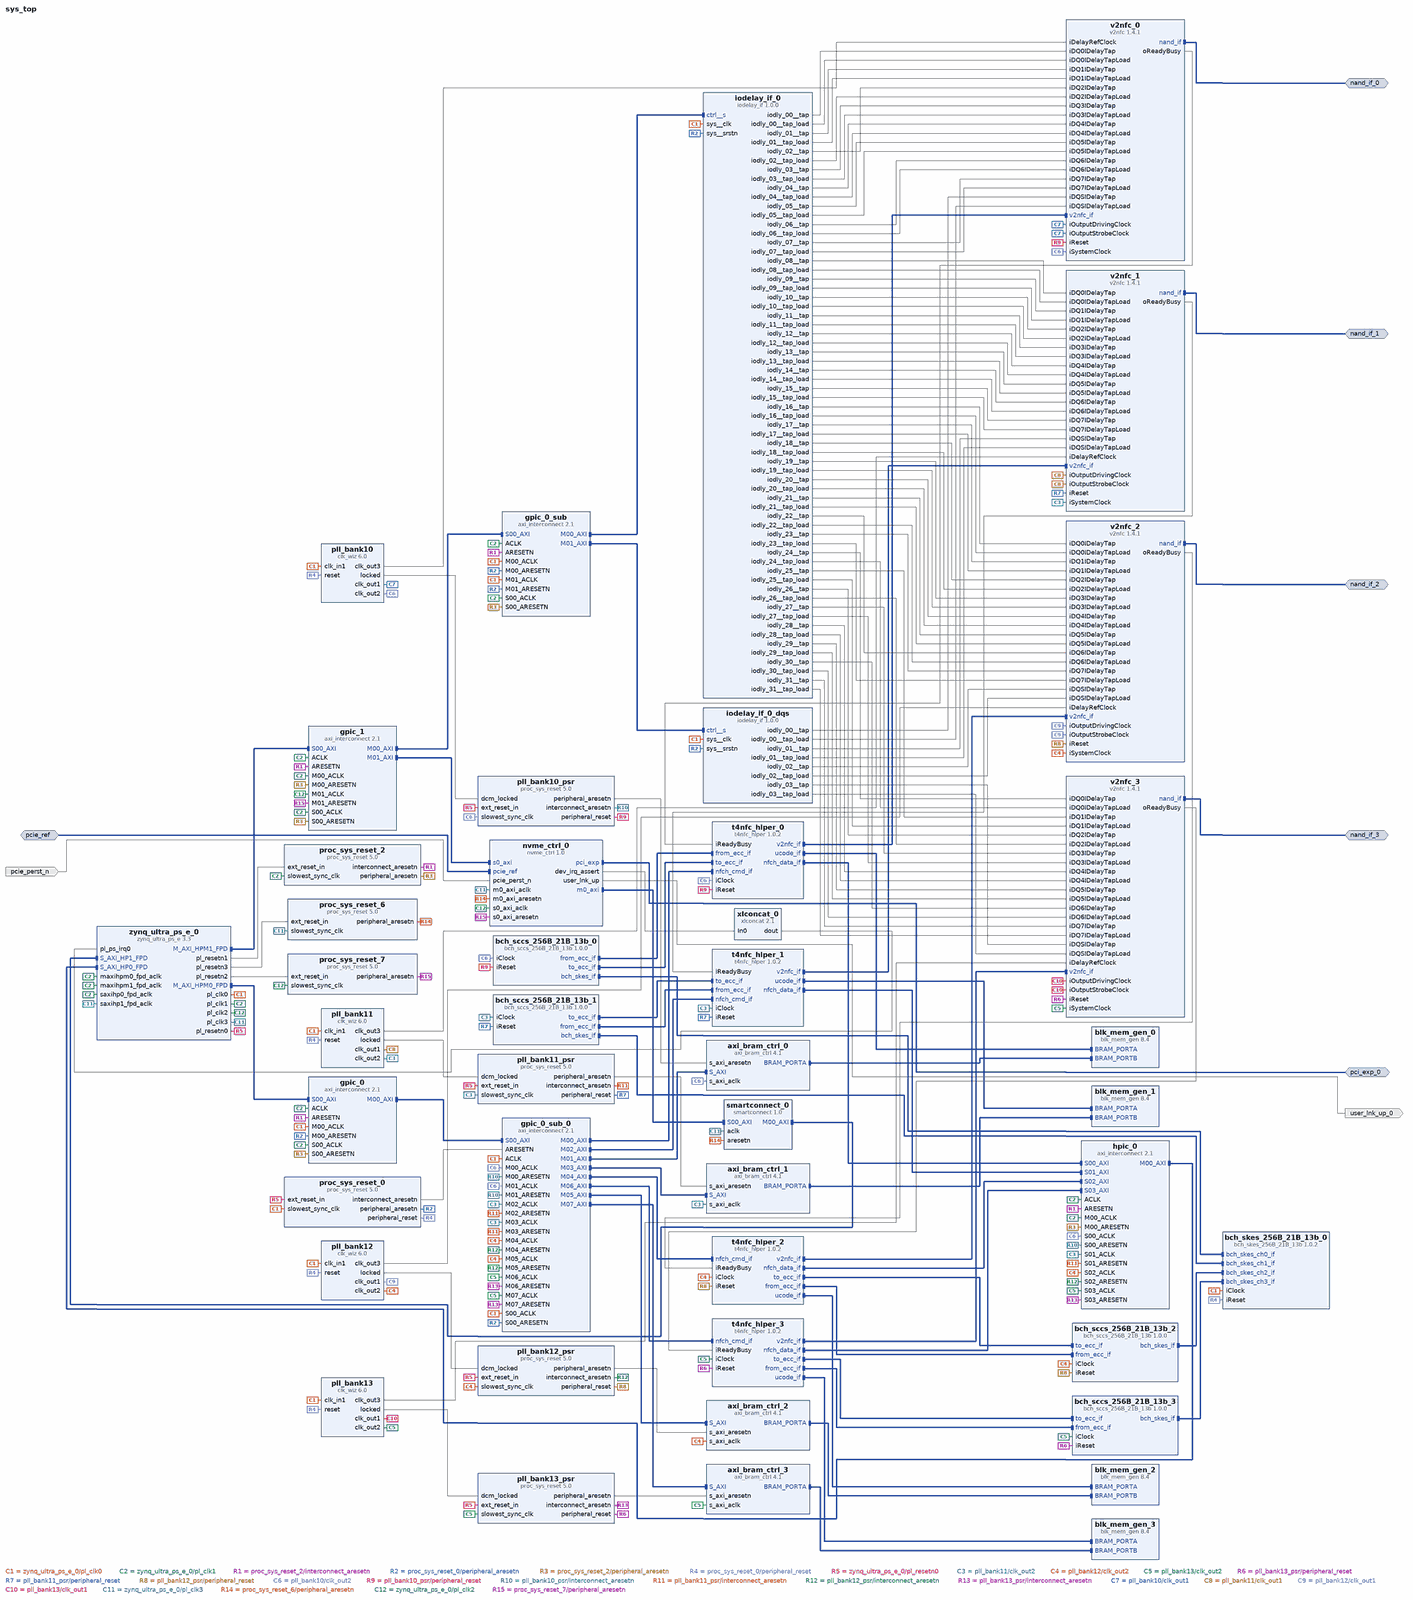
[diagram p0: block diagram of the top level, whole]
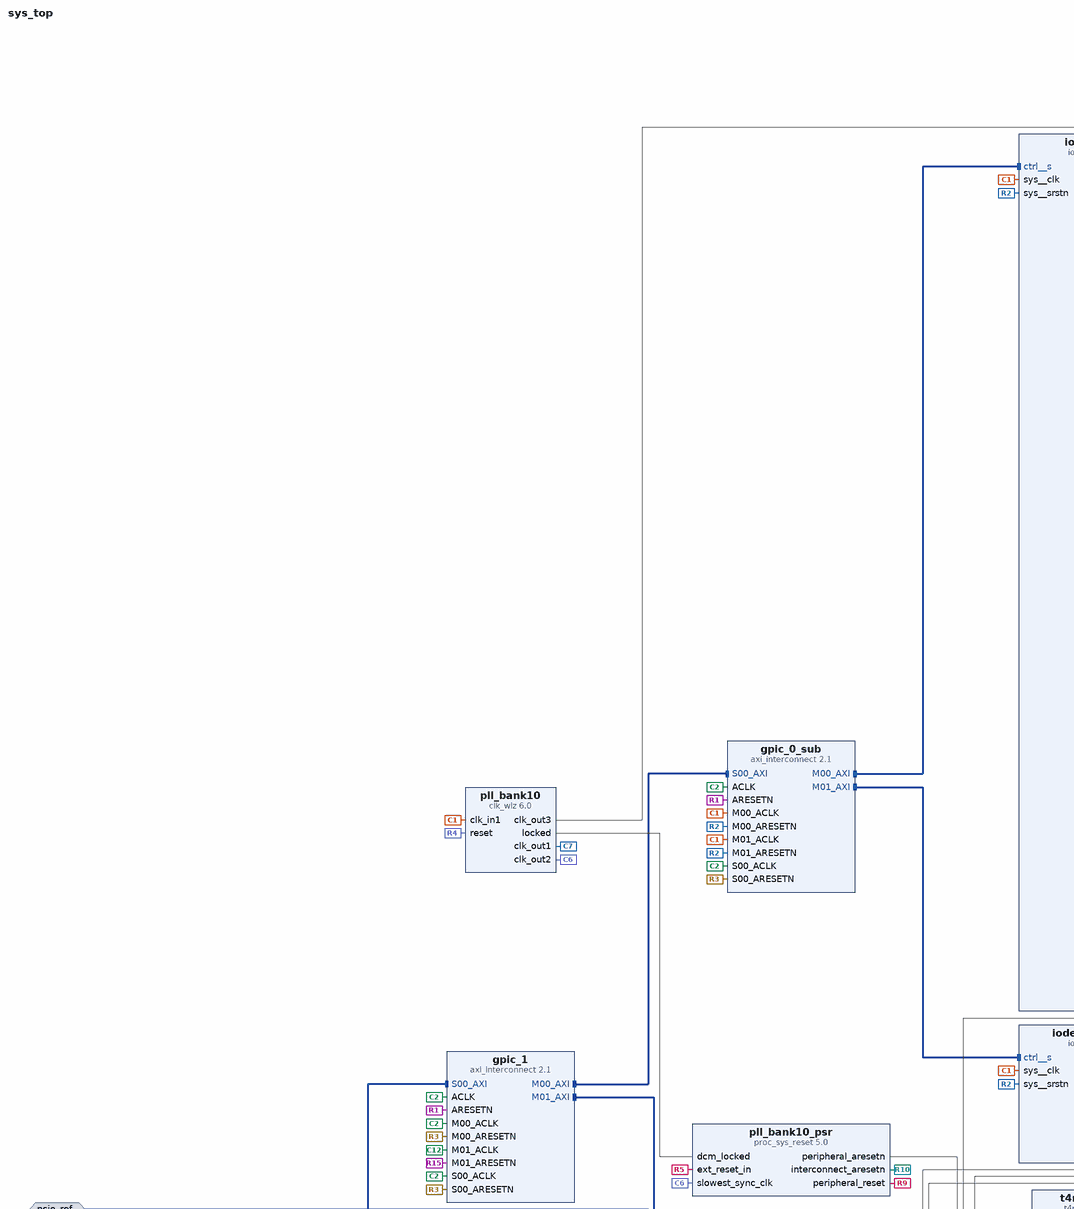
[diagram p1: block diagram of the top level, upper left part]
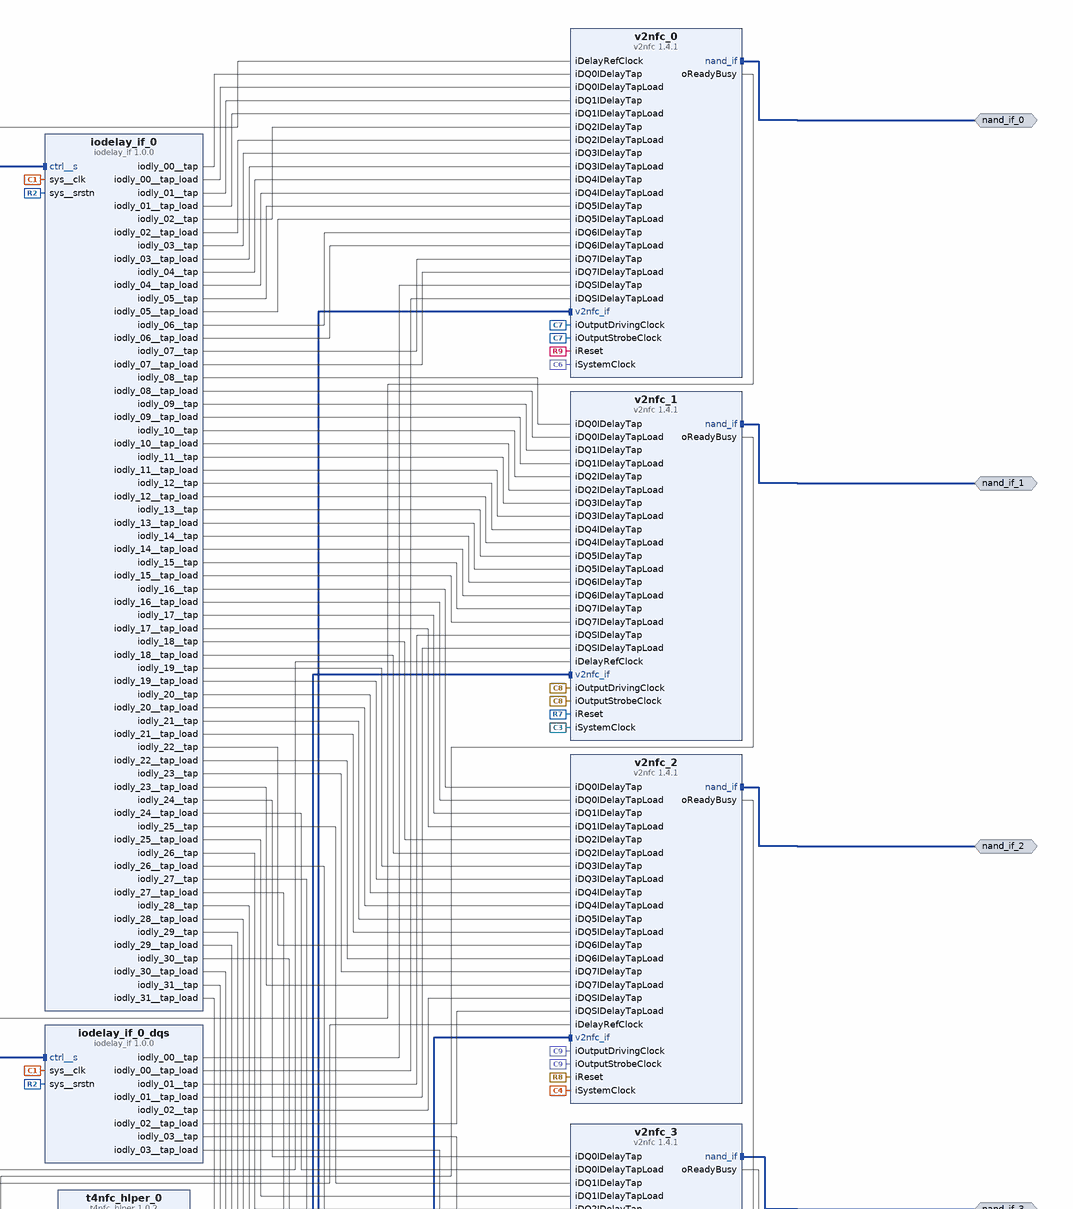
[diagram p2: block diagram of the top level, upper right part]
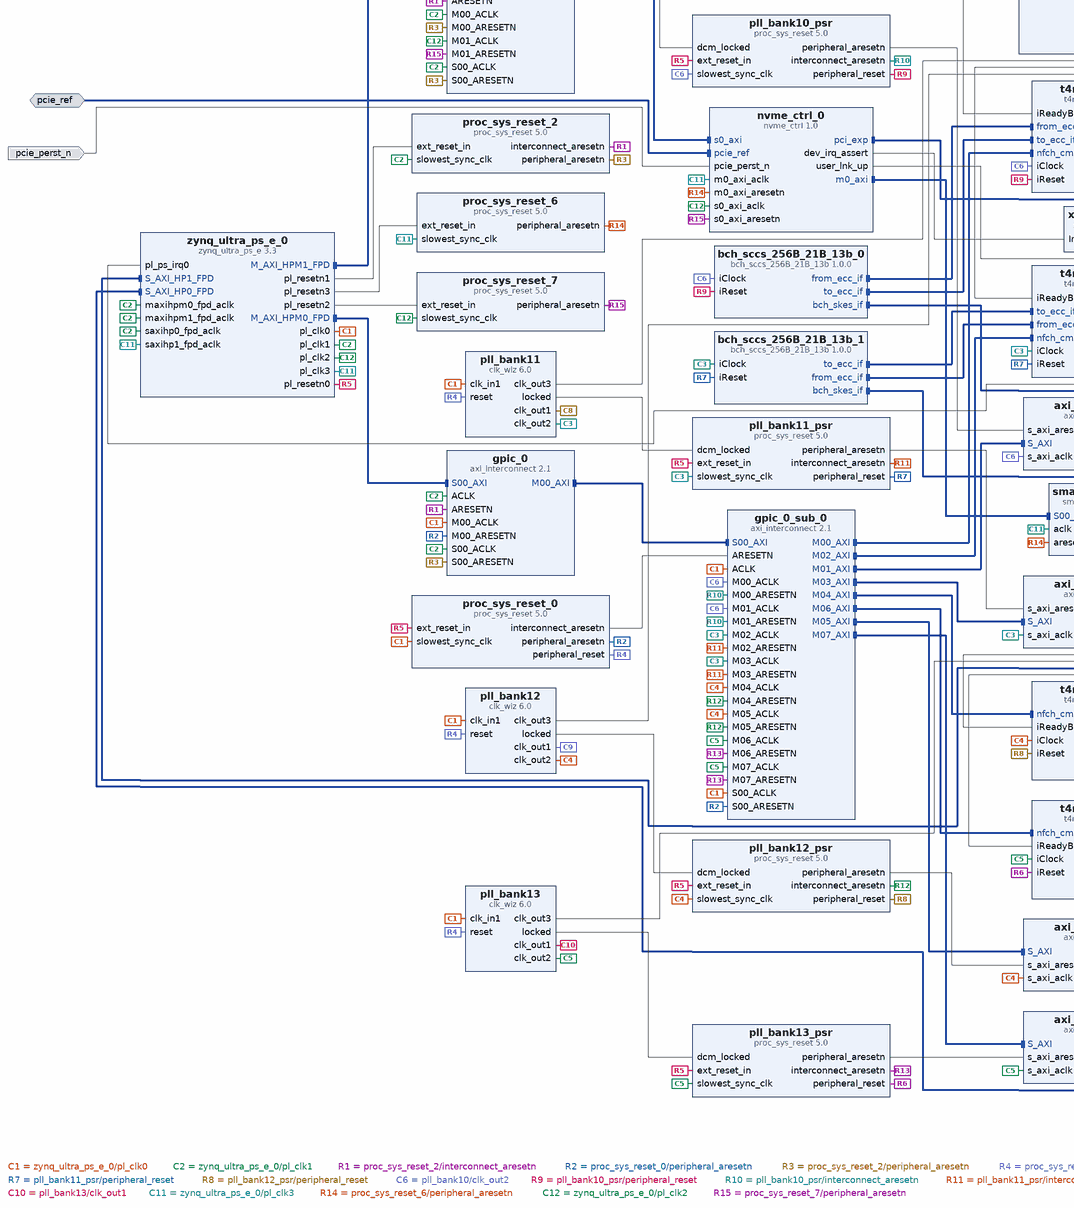
[diagram p3: block diagram of the top level, lower left part]
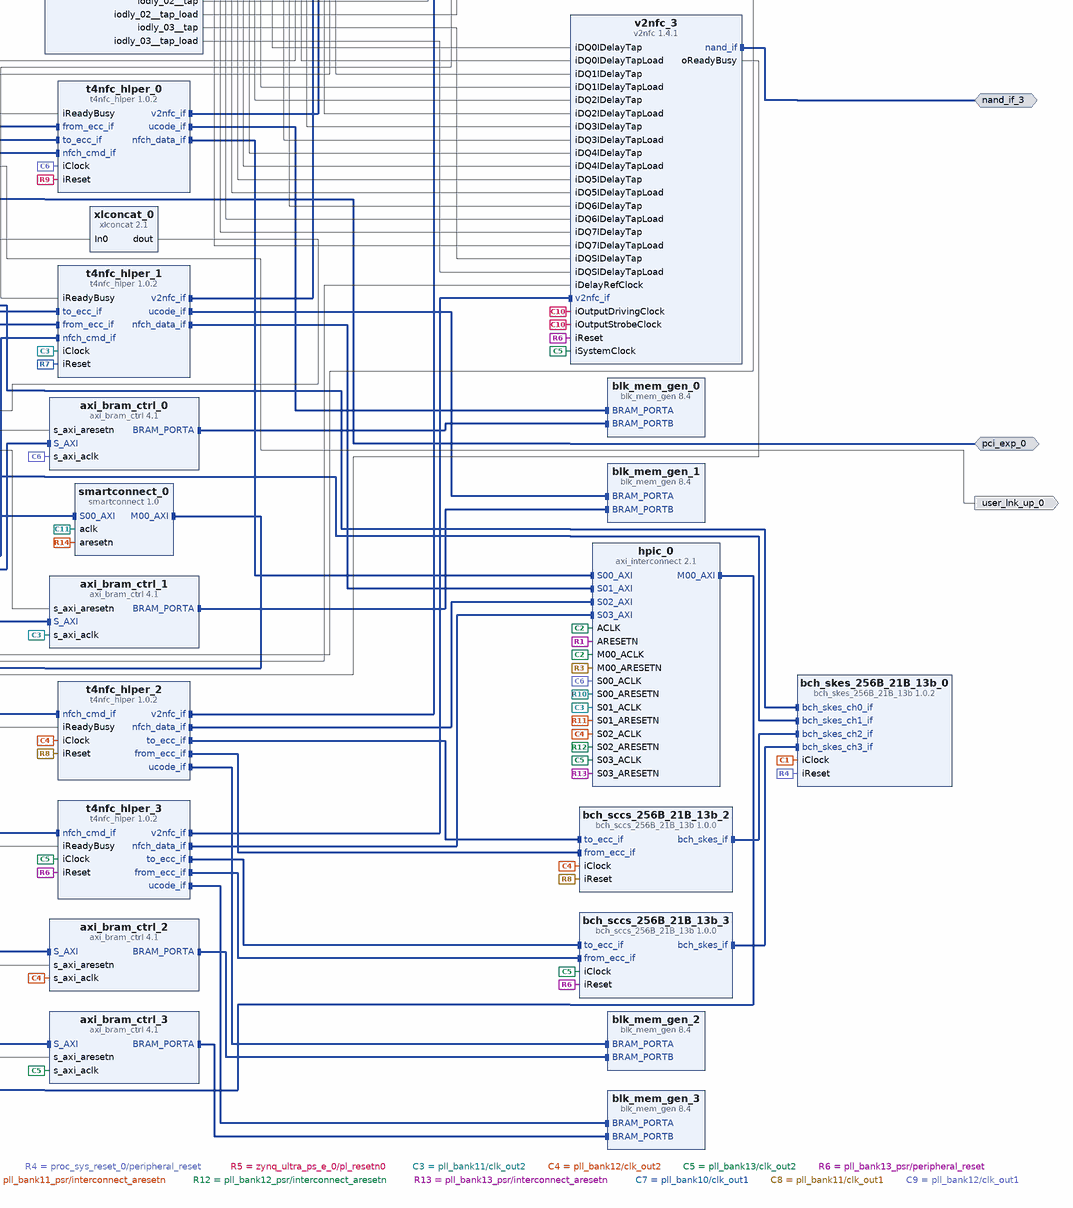
[diagram p4: block diagram of the top level, lower right part]
# Vivado block design sys_top, xczu17eg-ffvc1760-2-e, Vivado 2019.1
create_bd_design sys_top

create_bd_intf_port -mode Master -vlnv enclab:user:nand_if_rtl:1.0 nand_if_0
create_bd_intf_port -mode Master -vlnv enclab:user:nand_if_rtl:1.0 nand_if_1
create_bd_intf_port -mode Master -vlnv enclab:user:nand_if_rtl:1.0 nand_if_2
create_bd_intf_port -mode Master -vlnv enclab:user:nand_if_rtl:1.0 nand_if_3
create_bd_intf_port -mode Master -vlnv xilinx.com:interface:pcie_7x_mgt_rtl:1.0 pci_exp_0
create_bd_intf_port -mode Slave -vlnv xilinx.com:interface:diff_clock_rtl:1.0 pcie_ref
create_bd_port -dir O user_lnk_up_0
create_bd_port -dir I -type rst pcie_perst_n

create_bd_cell -type ip -vlnv xilinx.com:ip:zynq_ultra_ps_e:3.3 zynq_ultra_ps_e_0
set_property -dict [list \
  CONFIG.PSU__CRF_APB__DDR_CTRL__FREQMHZ 1066 \
  CONFIG.PSU__CRL_APB__PL0_REF_CTRL__FREQMHZ 50 \
  CONFIG.PSU__CRL_APB__PL0_REF_CTRL__SRCSEL DPLL \
  CONFIG.PSU__CRL_APB__PL1_REF_CTRL__FREQMHZ 200 \
  CONFIG.PSU__CRL_APB__PL1_REF_CTRL__SRCSEL DPLL \
  CONFIG.PSU__CRL_APB__PL2_REF_CTRL__FREQMHZ 200 \
  CONFIG.PSU__CRL_APB__PL3_REF_CTRL__FREQMHZ 250 \
  CONFIG.PSU__DDRC__BUS_WIDTH {32 Bit} \
  CONFIG.PSU__DDRC__DEVICE_CAPACITY {16384 MBits} \
  CONFIG.PSU__DDRC__DRAM_WIDTH {32 Bits} \
  CONFIG.PSU__DDRC__MEMORY_TYPE {LPDDR 4} \
  CONFIG.PSU__DDRC__SPEED_BIN LPDDR4_2133 \
  CONFIG.PSU__DDR_HIGH_ADDRESS_GUI_ENABLE 0 \
  CONFIG.PSU__DDR__INTERFACE__FREQMHZ 533.000 \
  CONFIG.PSU__DLL__ISUSED 1 \
  CONFIG.PSU__ENET3__FIFO__ENABLE 0 \
  CONFIG.PSU__ENET3__GRP_MDIO__ENABLE 1 \
  CONFIG.PSU__ENET3__GRP_MDIO__IO {MIO 76 .. 77} \
  CONFIG.PSU__ENET3__PERIPHERAL__ENABLE 1 \
  CONFIG.PSU__ENET3__PERIPHERAL__IO {MIO 64 .. 75} \
  CONFIG.PSU__ENET3__PTP__ENABLE 0 \
  CONFIG.PSU__ENET3__TSU__ENABLE 0 \
  CONFIG.PSU__FPGA_PL1_ENABLE 1 \
  CONFIG.PSU__FPGA_PL2_ENABLE 1 \
  CONFIG.PSU__FPGA_PL3_ENABLE 1 \
  CONFIG.PSU__GEM3_COHERENCY 0 \
  CONFIG.PSU__GEM3_ROUTE_THROUGH_FPD 0 \
  CONFIG.PSU__GEM__TSU__ENABLE 0 \
  CONFIG.PSU__GPIO_EMIO__WIDTH {[91:0]} \
  CONFIG.PSU__I2C0__PERIPHERAL__ENABLE 1 \
  CONFIG.PSU__I2C0__PERIPHERAL__IO {MIO 14 .. 15} \
  CONFIG.PSU__I2C1__PERIPHERAL__ENABLE 1 \
  CONFIG.PSU__I2C1__PERIPHERAL__IO {MIO 16 .. 17} \
  CONFIG.PSU__MAXIGP0__DATA_WIDTH 64 \
  CONFIG.PSU__MAXIGP1__DATA_WIDTH 64 \
  CONFIG.PSU__NUM_FABRIC_RESETS 4 \
  CONFIG.PSU__QSPI_COHERENCY 0 \
  CONFIG.PSU__QSPI_ROUTE_THROUGH_FPD 0 \
  CONFIG.PSU__QSPI__GRP_FBCLK__ENABLE 0 \
  CONFIG.PSU__QSPI__PERIPHERAL__DATA_MODE x4 \
  CONFIG.PSU__QSPI__PERIPHERAL__ENABLE 1 \
  CONFIG.PSU__QSPI__PERIPHERAL__IO {MIO 0 .. 12} \
  CONFIG.PSU__QSPI__PERIPHERAL__MODE {Dual Parallel} \
  CONFIG.PSU__SAXIGP2__DATA_WIDTH 64 \
  CONFIG.PSU__SAXIGP3__DATA_WIDTH 64 \
  CONFIG.PSU__SD1_COHERENCY 0 \
  CONFIG.PSU__SD1_ROUTE_THROUGH_FPD 0 \
  CONFIG.PSU__SD1__DATA_TRANSFER_MODE 4Bit \
  CONFIG.PSU__SD1__GRP_CD__ENABLE 1 \
  CONFIG.PSU__SD1__GRP_CD__IO {MIO 45} \
  CONFIG.PSU__SD1__GRP_POW__ENABLE 0 \
  CONFIG.PSU__SD1__GRP_WP__ENABLE 0 \
  CONFIG.PSU__SD1__PERIPHERAL__ENABLE 1 \
  CONFIG.PSU__SD1__PERIPHERAL__IO {MIO 46 .. 51} \
  CONFIG.PSU__SD1__SLOT_TYPE {SD 2.0} \
  CONFIG.PSU__TSU__BUFG_PORT_PAIR 0 \
  CONFIG.PSU__UART0__BAUD_RATE 115200 \
  CONFIG.PSU__UART0__MODEM__ENABLE 0 \
  CONFIG.PSU__UART0__PERIPHERAL__ENABLE 1 \
  CONFIG.PSU__UART0__PERIPHERAL__IO {MIO 18 .. 19} \
  CONFIG.PSU__UART1__BAUD_RATE 115200 \
  CONFIG.PSU__UART1__MODEM__ENABLE 0 \
  CONFIG.PSU__UART1__PERIPHERAL__ENABLE 1 \
  CONFIG.PSU__UART1__PERIPHERAL__IO {MIO 20 .. 21} \
  CONFIG.PSU__USE__IRQ0 1 \
  CONFIG.PSU__USE__M_AXI_GP0 1 \
  CONFIG.PSU__USE__M_AXI_GP1 1 \
  CONFIG.PSU__USE__M_AXI_GP2 0 \
  CONFIG.PSU__USE__S_AXI_GP2 1 \
  CONFIG.PSU__USE__S_AXI_GP3 1 \
  CONFIG.SUBPRESET1 Custom \
] [get_bd_cells zynq_ultra_ps_e_0]
# 81 more settings of zynq_ultra_ps_e_0 are not shown: defaults, MIO pin electricals, DDR timing, and values the tool derives
create_bd_cell -type ip -vlnv xilinx.com:ip:axi_bram_ctrl:4.1 axi_bram_ctrl_0
set_property -dict {CONFIG.SINGLE_PORT_BRAM 1} [get_bd_cells axi_bram_ctrl_0]
create_bd_cell -type ip -vlnv xilinx.com:ip:axi_bram_ctrl:4.1 axi_bram_ctrl_1
set_property -dict {CONFIG.SINGLE_PORT_BRAM 1} [get_bd_cells axi_bram_ctrl_1]
create_bd_cell -type ip -vlnv xilinx.com:ip:axi_bram_ctrl:4.1 axi_bram_ctrl_2
set_property -dict {CONFIG.SINGLE_PORT_BRAM 1} [get_bd_cells axi_bram_ctrl_2]
create_bd_cell -type ip -vlnv xilinx.com:ip:axi_bram_ctrl:4.1 axi_bram_ctrl_3
set_property -dict {CONFIG.SINGLE_PORT_BRAM 1} [get_bd_cells axi_bram_ctrl_3]
create_bd_cell -type ip -vlnv enclab:user:bch_sccs_256B_21B_13b:1.0.0 bch_sccs_256B_21B_13b_0
create_bd_cell -type ip -vlnv enclab:user:bch_sccs_256B_21B_13b:1.0.0 bch_sccs_256B_21B_13b_1
create_bd_cell -type ip -vlnv enclab:user:bch_sccs_256B_21B_13b:1.0.0 bch_sccs_256B_21B_13b_2
create_bd_cell -type ip -vlnv enclab:user:bch_sccs_256B_21B_13b:1.0.0 bch_sccs_256B_21B_13b_3
create_bd_cell -type ip -vlnv xilinx.com:ip:blk_mem_gen:8.4 blk_mem_gen_0
set_property -dict [list \
  CONFIG.Assume_Synchronous_Clk true \
  CONFIG.EN_SAFETY_CKT false \
  CONFIG.Enable_32bit_Address true \
  CONFIG.Enable_B Use_ENB_Pin \
  CONFIG.Memory_Type True_Dual_Port_RAM \
  CONFIG.Port_B_Clock 100 \
  CONFIG.Port_B_Enable_Rate 100 \
  CONFIG.Port_B_Write_Rate 50 \
  CONFIG.Register_PortA_Output_of_Memory_Primitives false \
  CONFIG.Register_PortB_Output_of_Memory_Primitives false \
  CONFIG.Use_RSTA_Pin true \
  CONFIG.Use_RSTB_Pin true \
  CONFIG.Write_Depth_A 2048 \
  CONFIG.use_bram_block Stand_Alone \
] [get_bd_cells blk_mem_gen_0]
create_bd_cell -type ip -vlnv xilinx.com:ip:blk_mem_gen:8.4 blk_mem_gen_1
set_property -dict [list \
  CONFIG.Assume_Synchronous_Clk true \
  CONFIG.EN_SAFETY_CKT false \
  CONFIG.Enable_32bit_Address true \
  CONFIG.Enable_B Use_ENB_Pin \
  CONFIG.Memory_Type True_Dual_Port_RAM \
  CONFIG.Port_B_Clock 100 \
  CONFIG.Port_B_Enable_Rate 100 \
  CONFIG.Port_B_Write_Rate 50 \
  CONFIG.Register_PortA_Output_of_Memory_Primitives false \
  CONFIG.Register_PortB_Output_of_Memory_Primitives false \
  CONFIG.Use_RSTA_Pin true \
  CONFIG.Use_RSTB_Pin true \
  CONFIG.Write_Depth_A 2048 \
  CONFIG.use_bram_block Stand_Alone \
] [get_bd_cells blk_mem_gen_1]
create_bd_cell -type ip -vlnv xilinx.com:ip:blk_mem_gen:8.4 blk_mem_gen_2
set_property -dict [list \
  CONFIG.Assume_Synchronous_Clk true \
  CONFIG.EN_SAFETY_CKT false \
  CONFIG.Enable_32bit_Address true \
  CONFIG.Enable_B Use_ENB_Pin \
  CONFIG.Memory_Type True_Dual_Port_RAM \
  CONFIG.Port_B_Clock 100 \
  CONFIG.Port_B_Enable_Rate 100 \
  CONFIG.Port_B_Write_Rate 50 \
  CONFIG.Register_PortA_Output_of_Memory_Primitives false \
  CONFIG.Register_PortB_Output_of_Memory_Primitives false \
  CONFIG.Use_RSTA_Pin true \
  CONFIG.Use_RSTB_Pin true \
  CONFIG.Write_Depth_A 2048 \
  CONFIG.use_bram_block Stand_Alone \
] [get_bd_cells blk_mem_gen_2]
create_bd_cell -type ip -vlnv xilinx.com:ip:blk_mem_gen:8.4 blk_mem_gen_3
set_property -dict [list \
  CONFIG.Assume_Synchronous_Clk true \
  CONFIG.EN_SAFETY_CKT false \
  CONFIG.Enable_32bit_Address true \
  CONFIG.Enable_B Use_ENB_Pin \
  CONFIG.Memory_Type True_Dual_Port_RAM \
  CONFIG.Port_B_Clock 100 \
  CONFIG.Port_B_Enable_Rate 100 \
  CONFIG.Port_B_Write_Rate 50 \
  CONFIG.Register_PortA_Output_of_Memory_Primitives false \
  CONFIG.Register_PortB_Output_of_Memory_Primitives false \
  CONFIG.Use_RSTA_Pin true \
  CONFIG.Use_RSTB_Pin true \
  CONFIG.Write_Depth_A 2048 \
  CONFIG.use_bram_block Stand_Alone \
] [get_bd_cells blk_mem_gen_3]
create_bd_cell -type ip -vlnv xilinx.com:ip:axi_interconnect:2.1 gpic_0
set_property -dict [list \
  CONFIG.ENABLE_ADVANCED_OPTIONS 0 \
  CONFIG.NUM_MI 1 \
  CONFIG.S00_HAS_DATA_FIFO 2 \
  CONFIG.STRATEGY 0 \
] [get_bd_cells gpic_0]
create_bd_cell -type ip -vlnv xilinx.com:ip:axi_interconnect:2.1 gpic_0_sub_0
set_property -dict [list \
  CONFIG.ENABLE_ADVANCED_OPTIONS 0 \
  CONFIG.NUM_MI 8 \
  CONFIG.S00_HAS_DATA_FIFO 2 \
  CONFIG.STRATEGY 2 \
] [get_bd_cells gpic_0_sub_0]
create_bd_cell -type ip -vlnv xilinx.com:ip:axi_interconnect:2.1 gpic_1
set_property -dict {CONFIG.NUM_MI 2 CONFIG.S00_HAS_DATA_FIFO 2 CONFIG.STRATEGY 0} [get_bd_cells gpic_1]
create_bd_cell -type ip -vlnv xilinx.com:ip:axi_interconnect:2.1 gpic_0_sub
set_property -dict {CONFIG.NUM_MI 2 CONFIG.S00_HAS_DATA_FIFO 2 CONFIG.STRATEGY 0} [get_bd_cells gpic_0_sub]
create_bd_cell -type ip -vlnv xilinx.com:ip:axi_interconnect:2.1 hpic_0
set_property -dict [list \
  CONFIG.ENABLE_ADVANCED_OPTIONS 0 \
  CONFIG.M00_HAS_DATA_FIFO 0 \
  CONFIG.NUM_MI 1 \
  CONFIG.NUM_SI 4 \
  CONFIG.S00_HAS_DATA_FIFO 2 \
  CONFIG.S00_HAS_REGSLICE 4 \
  CONFIG.S01_HAS_DATA_FIFO 2 \
  CONFIG.S01_HAS_REGSLICE 4 \
  CONFIG.S02_HAS_DATA_FIFO 2 \
  CONFIG.S02_HAS_REGSLICE 4 \
  CONFIG.S03_HAS_DATA_FIFO 2 \
  CONFIG.S03_HAS_REGSLICE 4 \
  CONFIG.STRATEGY 2 \
  CONFIG.SYNCHRONIZATION_STAGES 4 \
  CONFIG.XBAR_DATA_WIDTH 64 \
] [get_bd_cells hpic_0]
create_bd_cell -type ip -vlnv xilinx.com:ip:clk_wiz:6.0 pll_bank11
set_property -dict [list \
  CONFIG.CLKIN1_JITTER_PS 200.0 \
  CONFIG.CLKOUT1_DRIVES BUFG \
  CONFIG.CLKOUT1_JITTER 139.132 \
  CONFIG.CLKOUT1_PHASE_ERROR 154.682 \
  CONFIG.CLKOUT1_REQUESTED_OUT_FREQ 100 \
  CONFIG.CLKOUT1_REQUESTED_PHASE 0 \
  CONFIG.CLKOUT2_DRIVES BUFG \
  CONFIG.CLKOUT2_JITTER 163.701 \
  CONFIG.CLKOUT2_PHASE_ERROR 154.682 \
  CONFIG.CLKOUT2_REQUESTED_OUT_FREQ 50 \
  CONFIG.CLKOUT2_USED true \
  CONFIG.CLKOUT3_DRIVES BUFG \
  CONFIG.CLKOUT3_JITTER 124.137 \
  CONFIG.CLKOUT3_PHASE_ERROR 154.682 \
  CONFIG.CLKOUT3_REQUESTED_OUT_FREQ 200.000 \
  CONFIG.CLKOUT3_USED true \
  CONFIG.CLKOUT4_DRIVES Buffer \
  CONFIG.CLKOUT5_DRIVES Buffer \
  CONFIG.CLKOUT6_DRIVES Buffer \
  CONFIG.CLKOUT7_DRIVES Buffer \
  CONFIG.FEEDBACK_SOURCE FDBK_AUTO \
  CONFIG.JITTER_SEL No_Jitter \
  CONFIG.MMCM_BANDWIDTH OPTIMIZED \
  CONFIG.MMCM_CLKFBOUT_MULT_F 24.000 \
  CONFIG.MMCM_CLKIN1_PERIOD 20.000 \
  CONFIG.MMCM_CLKIN2_PERIOD 10.0 \
  CONFIG.MMCM_CLKOUT0_DIVIDE_F 12.000 \
  CONFIG.MMCM_CLKOUT0_PHASE 0.000 \
  CONFIG.MMCM_CLKOUT1_DIVIDE 24 \
  CONFIG.MMCM_CLKOUT2_DIVIDE 6 \
  CONFIG.MMCM_COMPENSATION AUTO \
  CONFIG.MMCM_DIVCLK_DIVIDE 1 \
  CONFIG.NUM_OUT_CLKS 3 \
  CONFIG.PHASESHIFT_MODE LATENCY \
  CONFIG.PRIM_SOURCE Global_buffer \
  CONFIG.USE_LOCKED true \
  CONFIG.USE_PHASE_ALIGNMENT true \
  CONFIG.USE_RESET true \
] [get_bd_cells pll_bank11]
create_bd_cell -type ip -vlnv xilinx.com:ip:clk_wiz:6.0 pll_bank12
set_property -dict [list \
  CONFIG.CLKIN1_JITTER_PS 200.0 \
  CONFIG.CLKOUT1_DRIVES BUFG \
  CONFIG.CLKOUT1_JITTER 106.955 \
  CONFIG.CLKOUT1_PHASE_ERROR 120.362 \
  CONFIG.CLKOUT1_REQUESTED_OUT_FREQ 100 \
  CONFIG.CLKOUT2_DRIVES BUFG \
  CONFIG.CLKOUT2_JITTER 118.642 \
  CONFIG.CLKOUT2_PHASE_ERROR 120.362 \
  CONFIG.CLKOUT2_REQUESTED_OUT_FREQ 50 \
  CONFIG.CLKOUT2_USED true \
  CONFIG.CLKOUT3_DRIVES BUFG \
  CONFIG.CLKOUT3_JITTER 96.669 \
  CONFIG.CLKOUT3_PHASE_ERROR 120.362 \
  CONFIG.CLKOUT3_REQUESTED_OUT_FREQ 200.000 \
  CONFIG.CLKOUT3_USED true \
  CONFIG.CLKOUT4_DRIVES Buffer \
  CONFIG.CLKOUT5_DRIVES Buffer \
  CONFIG.CLKOUT6_DRIVES Buffer \
  CONFIG.CLKOUT7_DRIVES Buffer \
  CONFIG.FEEDBACK_SOURCE FDBK_AUTO \
  CONFIG.JITTER_SEL Min_O_Jitter \
  CONFIG.MMCM_BANDWIDTH HIGH \
  CONFIG.MMCM_CLKFBOUT_MULT_F 32.000 \
  CONFIG.MMCM_CLKIN1_PERIOD 20.0 \
  CONFIG.MMCM_CLKIN2_PERIOD 10.0 \
  CONFIG.MMCM_CLKOUT0_DIVIDE_F 16.000 \
  CONFIG.MMCM_CLKOUT1_DIVIDE 32 \
  CONFIG.MMCM_CLKOUT2_DIVIDE 8 \
  CONFIG.MMCM_DIVCLK_DIVIDE 1 \
  CONFIG.NUM_OUT_CLKS 3 \
  CONFIG.PRIM_SOURCE Global_buffer \
  CONFIG.SECONDARY_SOURCE Single_ended_clock_capable_pin \
  CONFIG.USE_LOCKED true \
  CONFIG.USE_PHASE_ALIGNMENT true \
  CONFIG.USE_RESET true \
] [get_bd_cells pll_bank12]
create_bd_cell -type ip -vlnv xilinx.com:ip:clk_wiz:6.0 pll_bank13
set_property -dict [list \
  CONFIG.CLKIN1_JITTER_PS 200.0 \
  CONFIG.CLKOUT1_DRIVES BUFG \
  CONFIG.CLKOUT1_JITTER 106.955 \
  CONFIG.CLKOUT1_PHASE_ERROR 120.362 \
  CONFIG.CLKOUT1_REQUESTED_OUT_FREQ 100 \
  CONFIG.CLKOUT2_DRIVES BUFG \
  CONFIG.CLKOUT2_JITTER 118.642 \
  CONFIG.CLKOUT2_PHASE_ERROR 120.362 \
  CONFIG.CLKOUT2_REQUESTED_OUT_FREQ 50 \
  CONFIG.CLKOUT2_USED true \
  CONFIG.CLKOUT3_DRIVES BUFG \
  CONFIG.CLKOUT3_JITTER 96.669 \
  CONFIG.CLKOUT3_PHASE_ERROR 120.362 \
  CONFIG.CLKOUT3_REQUESTED_OUT_FREQ 200.000 \
  CONFIG.CLKOUT3_USED true \
  CONFIG.CLKOUT4_DRIVES Buffer \
  CONFIG.CLKOUT5_DRIVES Buffer \
  CONFIG.CLKOUT6_DRIVES Buffer \
  CONFIG.CLKOUT7_DRIVES Buffer \
  CONFIG.FEEDBACK_SOURCE FDBK_AUTO \
  CONFIG.JITTER_SEL Min_O_Jitter \
  CONFIG.MMCM_BANDWIDTH HIGH \
  CONFIG.MMCM_CLKFBOUT_MULT_F 32.000 \
  CONFIG.MMCM_CLKIN1_PERIOD 20.0 \
  CONFIG.MMCM_CLKIN2_PERIOD 10.0 \
  CONFIG.MMCM_CLKOUT0_DIVIDE_F 16.000 \
  CONFIG.MMCM_CLKOUT1_DIVIDE 32 \
  CONFIG.MMCM_CLKOUT2_DIVIDE 8 \
  CONFIG.MMCM_DIVCLK_DIVIDE 1 \
  CONFIG.NUM_OUT_CLKS 3 \
  CONFIG.PRIM_SOURCE Global_buffer \
  CONFIG.SECONDARY_SOURCE Single_ended_clock_capable_pin \
  CONFIG.USE_LOCKED true \
  CONFIG.USE_PHASE_ALIGNMENT true \
  CONFIG.USE_RESET true \
] [get_bd_cells pll_bank13]
create_bd_cell -type ip -vlnv xilinx.com:ip:proc_sys_reset:5.0 proc_sys_reset_0
create_bd_cell -type ip -vlnv xilinx.com:ip:proc_sys_reset:5.0 proc_sys_reset_2
create_bd_cell -type ip -vlnv enclab:user:t4nfc_hlper:1.0.2 t4nfc_hlper_0
create_bd_cell -type ip -vlnv enclab:user:t4nfc_hlper:1.0.2 t4nfc_hlper_1
create_bd_cell -type ip -vlnv enclab:user:t4nfc_hlper:1.0.2 t4nfc_hlper_2
create_bd_cell -type ip -vlnv enclab:user:t4nfc_hlper:1.0.2 t4nfc_hlper_3
create_bd_cell -type ip -vlnv enclab:user:bch_skes_256B_21B_13b:1.0.2 bch_skes_256B_21B_13b_0
create_bd_cell -type ip -vlnv ENCLab:user:iodelay_if:1.0.0 iodelay_if_0
create_bd_cell -type ip -vlnv ENCLab:user:iodelay_if:1.0.0 iodelay_if_0_dqs
create_bd_cell -type ip -vlnv xilinx.com:ip:proc_sys_reset:5.0 pll_bank13_psr
create_bd_cell -type ip -vlnv xilinx.com:ip:proc_sys_reset:5.0 pll_bank11_psr
create_bd_cell -type ip -vlnv xilinx.com:ip:proc_sys_reset:5.0 pll_bank12_psr
create_bd_cell -type ip -vlnv xilinx.com:ip:clk_wiz:6.0 pll_bank10
set_property -dict [list \
  CONFIG.CLKIN1_JITTER_PS 200.0 \
  CONFIG.CLKOUT1_DRIVES BUFG \
  CONFIG.CLKOUT1_JITTER 106.955 \
  CONFIG.CLKOUT1_PHASE_ERROR 120.362 \
  CONFIG.CLKOUT1_REQUESTED_OUT_FREQ 100 \
  CONFIG.CLKOUT2_DRIVES BUFG \
  CONFIG.CLKOUT2_JITTER 118.642 \
  CONFIG.CLKOUT2_PHASE_ERROR 120.362 \
  CONFIG.CLKOUT2_REQUESTED_OUT_FREQ 50 \
  CONFIG.CLKOUT2_USED true \
  CONFIG.CLKOUT3_DRIVES BUFG \
  CONFIG.CLKOUT3_JITTER 96.669 \
  CONFIG.CLKOUT3_PHASE_ERROR 120.362 \
  CONFIG.CLKOUT3_REQUESTED_OUT_FREQ 200.000 \
  CONFIG.CLKOUT3_USED true \
  CONFIG.CLKOUT4_DRIVES Buffer \
  CONFIG.CLKOUT5_DRIVES Buffer \
  CONFIG.CLKOUT6_DRIVES Buffer \
  CONFIG.CLKOUT7_DRIVES Buffer \
  CONFIG.FEEDBACK_SOURCE FDBK_AUTO \
  CONFIG.JITTER_SEL Min_O_Jitter \
  CONFIG.MMCM_BANDWIDTH HIGH \
  CONFIG.MMCM_CLKFBOUT_MULT_F 32.000 \
  CONFIG.MMCM_CLKIN1_PERIOD 20.0 \
  CONFIG.MMCM_CLKIN2_PERIOD 10.0 \
  CONFIG.MMCM_CLKOUT0_DIVIDE_F 16.000 \
  CONFIG.MMCM_CLKOUT1_DIVIDE 32 \
  CONFIG.MMCM_CLKOUT2_DIVIDE 8 \
  CONFIG.NUM_OUT_CLKS 3 \
  CONFIG.PRIM_SOURCE Global_buffer \
  CONFIG.SECONDARY_SOURCE Single_ended_clock_capable_pin \
  CONFIG.USE_LOCKED true \
  CONFIG.USE_PHASE_ALIGNMENT true \
  CONFIG.USE_RESET true \
] [get_bd_cells pll_bank10]
create_bd_cell -type ip -vlnv xilinx.com:ip:proc_sys_reset:5.0 pll_bank10_psr
create_bd_cell -type ip -vlnv xilinx.com:ip:xlconcat:2.1 xlconcat_0
set_property -dict {CONFIG.NUM_PORTS 1} [get_bd_cells xlconcat_0]
create_bd_cell -type ip -vlnv xilinx.com:ip:smartconnect:1.0 smartconnect_0
set_property -dict {CONFIG.NUM_SI 1} [get_bd_cells smartconnect_0]
create_bd_cell -type ip -vlnv xilinx.com:ip:proc_sys_reset:5.0 proc_sys_reset_6
create_bd_cell -type ip -vlnv xilinx.com:ip:proc_sys_reset:5.0 proc_sys_reset_7
create_bd_cell -type ip -vlnv enclab:user:v2nfc:1.4.1 v2nfc_0
set_property -dict [list \
  CONFIG.BufferType 1 \
  CONFIG.DQIDelayInst 0 \
  CONFIG.DQIDelayValue 1100 \
  CONFIG.IDelayValue 1100 \
  CONFIG.InputClockBufferType 1 \
] [get_bd_cells v2nfc_0]
create_bd_cell -type ip -vlnv enclab:user:v2nfc:1.4.1 v2nfc_1
set_property -dict [list \
  CONFIG.DQIDelayInst 0 \
  CONFIG.DQIDelayValue 1100 \
  CONFIG.IDelayCtrlInst 1 \
  CONFIG.IDelayValue 1100 \
  CONFIG.InputClockBufferType 1 \
] [get_bd_cells v2nfc_1]
create_bd_cell -type ip -vlnv enclab:user:v2nfc:1.4.1 v2nfc_2
set_property -dict [list \
  CONFIG.DQIDelayInst 0 \
  CONFIG.DQIDelayValue 1100 \
  CONFIG.IDelayValue 1100 \
  CONFIG.InputClockBufferType 1 \
] [get_bd_cells v2nfc_2]
create_bd_cell -type ip -vlnv enclab:user:v2nfc:1.4.1 v2nfc_3
set_property -dict [list \
  CONFIG.BufferType 1 \
  CONFIG.DQIDelayInst 0 \
  CONFIG.DQIDelayValue 1100 \
  CONFIG.IDelayValue 1100 \
  CONFIG.InputClockBufferType 1 \
] [get_bd_cells v2nfc_3]
create_bd_cell -type ip -vlnv crztech:user:nvme_ctrl:1.0 nvme_ctrl_0
set_property -dict {CONFIG.C_PCIE_DATA_WIDTH 512 CONFIG.C_S0_AXI_HIGHADDR 0xA000FFFF} [get_bd_cells nvme_ctrl_0]

# ---- connections ----

connect_bd_intf_net [get_bd_intf_pins t4nfc_hlper_1/v2nfc_if] [get_bd_intf_pins v2nfc_1/v2nfc_if]
connect_bd_intf_net [get_bd_intf_pins t4nfc_hlper_1/nfch_cmd_if] [get_bd_intf_pins gpic_0_sub_0/M02_AXI]
connect_bd_intf_net [get_bd_intf_ports pci_exp_0] [get_bd_intf_pins nvme_ctrl_0/pci_exp]
connect_bd_intf_net [get_bd_intf_pins blk_mem_gen_0/BRAM_PORTB] [get_bd_intf_pins axi_bram_ctrl_0/BRAM_PORTA]
connect_bd_intf_net [get_bd_intf_pins t4nfc_hlper_2/to_ecc_if] [get_bd_intf_pins bch_sccs_256B_21B_13b_2/to_ecc_if]
connect_bd_intf_net [get_bd_intf_pins bch_sccs_256B_21B_13b_3/bch_skes_if] [get_bd_intf_pins bch_skes_256B_21B_13b_0/bch_skes_ch3_if]
connect_bd_intf_net [get_bd_intf_pins hpic_0/M00_AXI] [get_bd_intf_pins zynq_ultra_ps_e_0/S_AXI_HP0_FPD]
connect_bd_intf_net [get_bd_intf_pins bch_sccs_256B_21B_13b_2/bch_skes_if] [get_bd_intf_pins bch_skes_256B_21B_13b_0/bch_skes_ch2_if]
connect_bd_intf_net [get_bd_intf_pins nvme_ctrl_0/m0_axi] [get_bd_intf_pins smartconnect_0/S00_AXI]
connect_bd_intf_net [get_bd_intf_pins t4nfc_hlper_0/ucode_if] [get_bd_intf_pins blk_mem_gen_0/BRAM_PORTA]
connect_bd_intf_net [get_bd_intf_pins t4nfc_hlper_3/v2nfc_if] [get_bd_intf_pins v2nfc_3/v2nfc_if]
connect_bd_intf_net [get_bd_intf_pins hpic_0/S03_AXI] [get_bd_intf_pins t4nfc_hlper_3/nfch_data_if]
connect_bd_intf_net [get_bd_intf_pins t4nfc_hlper_0/v2nfc_if] [get_bd_intf_pins v2nfc_0/v2nfc_if]
connect_bd_intf_net [get_bd_intf_pins bch_sccs_256B_21B_13b_1/bch_skes_if] [get_bd_intf_pins bch_skes_256B_21B_13b_0/bch_skes_ch1_if]
connect_bd_intf_net [get_bd_intf_ports nand_if_0] [get_bd_intf_pins v2nfc_0/nand_if]
connect_bd_intf_net [get_bd_intf_pins bch_sccs_256B_21B_13b_0/bch_skes_if] [get_bd_intf_pins bch_skes_256B_21B_13b_0/bch_skes_ch0_if]
connect_bd_intf_net [get_bd_intf_pins bch_sccs_256B_21B_13b_1/to_ecc_if] [get_bd_intf_pins t4nfc_hlper_1/to_ecc_if]
connect_bd_intf_net [get_bd_intf_pins gpic_0_sub_0/M06_AXI] [get_bd_intf_pins t4nfc_hlper_3/nfch_cmd_if]
connect_bd_intf_net [get_bd_intf_pins hpic_0/S01_AXI] [get_bd_intf_pins t4nfc_hlper_1/nfch_data_if]
connect_bd_intf_net [get_bd_intf_pins gpic_1/S00_AXI] [get_bd_intf_pins zynq_ultra_ps_e_0/M_AXI_HPM1_FPD]
connect_bd_intf_net -intf_net gpic_0_M01_AXI [get_bd_intf_pins gpic_0_sub_0/M01_AXI] [get_bd_intf_pins axi_bram_ctrl_0/S_AXI]
connect_bd_intf_net [get_bd_intf_pins bch_sccs_256B_21B_13b_1/from_ecc_if] [get_bd_intf_pins t4nfc_hlper_1/from_ecc_if]
connect_bd_intf_net -intf_net gpic_0_M05_AXI [get_bd_intf_pins gpic_0_sub_0/M05_AXI] [get_bd_intf_pins axi_bram_ctrl_2/S_AXI]
connect_bd_intf_net [get_bd_intf_pins t4nfc_hlper_3/to_ecc_if] [get_bd_intf_pins bch_sccs_256B_21B_13b_3/to_ecc_if]
connect_bd_intf_net [get_bd_intf_pins bch_sccs_256B_21B_13b_0/from_ecc_if] [get_bd_intf_pins t4nfc_hlper_0/from_ecc_if]
connect_bd_intf_net [get_bd_intf_pins blk_mem_gen_3/BRAM_PORTA] [get_bd_intf_pins t4nfc_hlper_3/ucode_if]
connect_bd_intf_net [get_bd_intf_pins t4nfc_hlper_2/ucode_if] [get_bd_intf_pins blk_mem_gen_2/BRAM_PORTA]
connect_bd_intf_net [get_bd_intf_pins zynq_ultra_ps_e_0/M_AXI_HPM0_FPD] [get_bd_intf_pins gpic_0/S00_AXI]
connect_bd_intf_net [get_bd_intf_ports nand_if_2] [get_bd_intf_pins v2nfc_2/nand_if]
connect_bd_intf_net [get_bd_intf_pins hpic_0/S02_AXI] [get_bd_intf_pins t4nfc_hlper_2/nfch_data_if]
connect_bd_intf_net [get_bd_intf_pins axi_bram_ctrl_3/BRAM_PORTA] [get_bd_intf_pins blk_mem_gen_3/BRAM_PORTB]
connect_bd_intf_net [get_bd_intf_pins t4nfc_hlper_2/nfch_cmd_if] [get_bd_intf_pins gpic_0_sub_0/M04_AXI]
connect_bd_intf_net [get_bd_intf_pins blk_mem_gen_1/BRAM_PORTA] [get_bd_intf_pins t4nfc_hlper_1/ucode_if]
connect_bd_intf_net -intf_net gpic_0_M03_AXI [get_bd_intf_pins gpic_0_sub_0/M03_AXI] [get_bd_intf_pins axi_bram_ctrl_1/S_AXI]
connect_bd_intf_net [get_bd_intf_pins t4nfc_hlper_3/from_ecc_if] [get_bd_intf_pins bch_sccs_256B_21B_13b_3/from_ecc_if]
connect_bd_intf_net [get_bd_intf_ports nand_if_1] [get_bd_intf_pins v2nfc_1/nand_if]
connect_bd_intf_net [get_bd_intf_pins t4nfc_hlper_0/nfch_data_if] [get_bd_intf_pins hpic_0/S00_AXI]
connect_bd_intf_net -intf_net pcie_ref_0_1 [get_bd_intf_ports pcie_ref] [get_bd_intf_pins nvme_ctrl_0/pcie_ref]
connect_bd_intf_net [get_bd_intf_pins t4nfc_hlper_2/from_ecc_if] [get_bd_intf_pins bch_sccs_256B_21B_13b_2/from_ecc_if]
connect_bd_intf_net [get_bd_intf_pins smartconnect_0/M00_AXI] [get_bd_intf_pins zynq_ultra_ps_e_0/S_AXI_HP1_FPD]
connect_bd_intf_net [get_bd_intf_ports nand_if_3] [get_bd_intf_pins v2nfc_3/nand_if]
connect_bd_intf_net [get_bd_intf_pins t4nfc_hlper_2/v2nfc_if] [get_bd_intf_pins v2nfc_2/v2nfc_if]
connect_bd_intf_net [get_bd_intf_pins gpic_1/M01_AXI] [get_bd_intf_pins nvme_ctrl_0/s0_axi]
connect_bd_intf_net -intf_net axi_interconnect_0_M00_AXI [get_bd_intf_pins gpic_0/M00_AXI] [get_bd_intf_pins gpic_0_sub_0/S00_AXI]
connect_bd_intf_net [get_bd_intf_pins axi_bram_ctrl_2/BRAM_PORTA] [get_bd_intf_pins blk_mem_gen_2/BRAM_PORTB]
connect_bd_intf_net [get_bd_intf_pins gpic_0_sub/M00_AXI] [get_bd_intf_pins iodelay_if_0/ctrl__s]
connect_bd_intf_net [get_bd_intf_pins bch_sccs_256B_21B_13b_0/to_ecc_if] [get_bd_intf_pins t4nfc_hlper_0/to_ecc_if]
connect_bd_intf_net [get_bd_intf_pins axi_bram_ctrl_1/BRAM_PORTA] [get_bd_intf_pins blk_mem_gen_1/BRAM_PORTB]
connect_bd_intf_net [get_bd_intf_pins gpic_0_sub/M01_AXI] [get_bd_intf_pins iodelay_if_0_dqs/ctrl__s]
connect_bd_intf_net [get_bd_intf_pins gpic_1/M00_AXI] [get_bd_intf_pins gpic_0_sub/S00_AXI]
connect_bd_intf_net [get_bd_intf_pins t4nfc_hlper_0/nfch_cmd_if] [get_bd_intf_pins gpic_0_sub_0/M00_AXI]
connect_bd_intf_net -intf_net gpic_0_M07_AXI [get_bd_intf_pins gpic_0_sub_0/M07_AXI] [get_bd_intf_pins axi_bram_ctrl_3/S_AXI]
connect_bd_net -net processing_system7_0_FCLK_CLK0 [get_bd_pins zynq_ultra_ps_e_0/pl_clk0] \
  [get_bd_pins gpic_0/M00_ACLK] [get_bd_pins gpic_0_sub_0/ACLK] [get_bd_pins gpic_0_sub_0/S00_ACLK] \
  [get_bd_pins gpic_0_sub/M00_ACLK] [get_bd_pins pll_bank11/clk_in1] [get_bd_pins pll_bank12/clk_in1] \
  [get_bd_pins pll_bank13/clk_in1] [get_bd_pins proc_sys_reset_0/slowest_sync_clk] \
  [get_bd_pins bch_skes_256B_21B_13b_0/iClock] [get_bd_pins gpic_0_sub/M01_ACLK] [get_bd_pins iodelay_if_0/sys__clk] \
  [get_bd_pins iodelay_if_0_dqs/sys__clk] [get_bd_pins pll_bank10/clk_in1]
connect_bd_net -net processing_system7_0_FCLK_CLK2 [get_bd_pins zynq_ultra_ps_e_0/pl_clk1] \
  [get_bd_pins zynq_ultra_ps_e_0/maxihpm0_fpd_aclk] [get_bd_pins zynq_ultra_ps_e_0/maxihpm1_fpd_aclk] \
  [get_bd_pins zynq_ultra_ps_e_0/saxihp0_fpd_aclk] [get_bd_pins gpic_0/ACLK] [get_bd_pins gpic_0/S00_ACLK] \
  [get_bd_pins gpic_1/ACLK] [get_bd_pins gpic_1/S00_ACLK] [get_bd_pins gpic_1/M00_ACLK] [get_bd_pins gpic_0_sub/ACLK] \
  [get_bd_pins gpic_0_sub/S00_ACLK] [get_bd_pins hpic_0/ACLK] [get_bd_pins hpic_0/M00_ACLK] \
  [get_bd_pins proc_sys_reset_2/slowest_sync_clk]
connect_bd_net -net ARESETN_1 [get_bd_pins proc_sys_reset_0/interconnect_aresetn] [get_bd_pins gpic_0_sub_0/ARESETN]
connect_bd_net [get_bd_pins proc_sys_reset_2/interconnect_aresetn] \
  [get_bd_pins gpic_0/ARESETN] [get_bd_pins gpic_1/ARESETN] [get_bd_pins gpic_0_sub/ARESETN] [get_bd_pins hpic_0/ARESETN]
connect_bd_net -net S00_ARESETN_1 [get_bd_pins proc_sys_reset_0/peripheral_aresetn] \
  [get_bd_pins gpic_0/M00_ARESETN] [get_bd_pins gpic_0_sub_0/S00_ARESETN] [get_bd_pins gpic_0_sub/M00_ARESETN] \
  [get_bd_pins gpic_0_sub/M01_ARESETN] [get_bd_pins iodelay_if_0/sys__srstn] [get_bd_pins iodelay_if_0_dqs/sys__srstn]
connect_bd_net -net M00_ARESETN_1 [get_bd_pins proc_sys_reset_2/peripheral_aresetn] \
  [get_bd_pins gpic_0/S00_ARESETN] [get_bd_pins gpic_1/S00_ARESETN] [get_bd_pins gpic_1/M00_ARESETN] \
  [get_bd_pins gpic_0_sub/S00_ARESETN] [get_bd_pins hpic_0/M00_ARESETN]
connect_bd_net [get_bd_pins proc_sys_reset_0/peripheral_reset] \
  [get_bd_pins bch_skes_256B_21B_13b_0/iReset] [get_bd_pins pll_bank10/reset] [get_bd_pins pll_bank11/reset] \
  [get_bd_pins pll_bank12/reset] [get_bd_pins pll_bank13/reset]
connect_bd_net [get_bd_pins v2nfc_0/oReadyBusy] [get_bd_pins t4nfc_hlper_0/iReadyBusy]
connect_bd_net [get_bd_pins v2nfc_1/oReadyBusy] [get_bd_pins t4nfc_hlper_1/iReadyBusy]
connect_bd_net [get_bd_pins v2nfc_2/oReadyBusy] [get_bd_pins t4nfc_hlper_2/iReadyBusy]
connect_bd_net [get_bd_pins v2nfc_3/oReadyBusy] [get_bd_pins t4nfc_hlper_3/iReadyBusy]
connect_bd_net [get_bd_pins iodelay_if_0/iodly_00__tap] [get_bd_pins v2nfc_0/iDQ0IDelayTap]
connect_bd_net [get_bd_pins iodelay_if_0/iodly_00__tap_load] [get_bd_pins v2nfc_0/iDQ0IDelayTapLoad]
connect_bd_net [get_bd_pins iodelay_if_0/iodly_01__tap] [get_bd_pins v2nfc_0/iDQ1IDelayTap]
connect_bd_net [get_bd_pins iodelay_if_0/iodly_01__tap_load] [get_bd_pins v2nfc_0/iDQ1IDelayTapLoad]
connect_bd_net [get_bd_pins iodelay_if_0/iodly_02__tap] [get_bd_pins v2nfc_0/iDQ2IDelayTap]
connect_bd_net [get_bd_pins iodelay_if_0/iodly_02__tap_load] [get_bd_pins v2nfc_0/iDQ2IDelayTapLoad]
connect_bd_net [get_bd_pins iodelay_if_0/iodly_03__tap] [get_bd_pins v2nfc_0/iDQ3IDelayTap]
connect_bd_net [get_bd_pins iodelay_if_0/iodly_03__tap_load] [get_bd_pins v2nfc_0/iDQ3IDelayTapLoad]
connect_bd_net [get_bd_pins iodelay_if_0/iodly_04__tap] [get_bd_pins v2nfc_0/iDQ4IDelayTap]
connect_bd_net [get_bd_pins iodelay_if_0/iodly_04__tap_load] [get_bd_pins v2nfc_0/iDQ4IDelayTapLoad]
connect_bd_net [get_bd_pins iodelay_if_0/iodly_05__tap] [get_bd_pins v2nfc_0/iDQ5IDelayTap]
connect_bd_net [get_bd_pins iodelay_if_0/iodly_05__tap_load] [get_bd_pins v2nfc_0/iDQ5IDelayTapLoad]
connect_bd_net [get_bd_pins iodelay_if_0/iodly_06__tap] [get_bd_pins v2nfc_0/iDQ6IDelayTap]
connect_bd_net [get_bd_pins iodelay_if_0/iodly_06__tap_load] [get_bd_pins v2nfc_0/iDQ6IDelayTapLoad]
connect_bd_net [get_bd_pins iodelay_if_0/iodly_07__tap] [get_bd_pins v2nfc_0/iDQ7IDelayTap]
connect_bd_net [get_bd_pins iodelay_if_0/iodly_07__tap_load] [get_bd_pins v2nfc_0/iDQ7IDelayTapLoad]
connect_bd_net [get_bd_pins iodelay_if_0/iodly_08__tap] [get_bd_pins v2nfc_1/iDQ0IDelayTap]
connect_bd_net [get_bd_pins iodelay_if_0/iodly_08__tap_load] [get_bd_pins v2nfc_1/iDQ0IDelayTapLoad]
connect_bd_net [get_bd_pins iodelay_if_0/iodly_09__tap] [get_bd_pins v2nfc_1/iDQ1IDelayTap]
connect_bd_net [get_bd_pins iodelay_if_0/iodly_09__tap_load] [get_bd_pins v2nfc_1/iDQ1IDelayTapLoad]
connect_bd_net [get_bd_pins iodelay_if_0/iodly_10__tap] [get_bd_pins v2nfc_1/iDQ2IDelayTap]
connect_bd_net [get_bd_pins iodelay_if_0/iodly_10__tap_load] [get_bd_pins v2nfc_1/iDQ2IDelayTapLoad]
connect_bd_net [get_bd_pins iodelay_if_0/iodly_11__tap] [get_bd_pins v2nfc_1/iDQ3IDelayTap]
connect_bd_net [get_bd_pins iodelay_if_0/iodly_11__tap_load] [get_bd_pins v2nfc_1/iDQ3IDelayTapLoad]
connect_bd_net [get_bd_pins iodelay_if_0/iodly_12__tap] [get_bd_pins v2nfc_1/iDQ4IDelayTap]
connect_bd_net [get_bd_pins iodelay_if_0/iodly_12__tap_load] [get_bd_pins v2nfc_1/iDQ4IDelayTapLoad]
connect_bd_net [get_bd_pins iodelay_if_0/iodly_13__tap] [get_bd_pins v2nfc_1/iDQ5IDelayTap]
connect_bd_net [get_bd_pins iodelay_if_0/iodly_13__tap_load] [get_bd_pins v2nfc_1/iDQ5IDelayTapLoad]
connect_bd_net [get_bd_pins iodelay_if_0/iodly_14__tap] [get_bd_pins v2nfc_1/iDQ6IDelayTap]
connect_bd_net [get_bd_pins iodelay_if_0/iodly_14__tap_load] [get_bd_pins v2nfc_1/iDQ6IDelayTapLoad]
connect_bd_net [get_bd_pins iodelay_if_0/iodly_15__tap] [get_bd_pins v2nfc_1/iDQ7IDelayTap]
connect_bd_net [get_bd_pins iodelay_if_0/iodly_15__tap_load] [get_bd_pins v2nfc_1/iDQ7IDelayTapLoad]
connect_bd_net [get_bd_pins iodelay_if_0/iodly_16__tap] [get_bd_pins v2nfc_2/iDQ0IDelayTap]
connect_bd_net [get_bd_pins iodelay_if_0/iodly_16__tap_load] [get_bd_pins v2nfc_2/iDQ0IDelayTapLoad]
connect_bd_net [get_bd_pins iodelay_if_0/iodly_17__tap] [get_bd_pins v2nfc_2/iDQ1IDelayTap]
connect_bd_net [get_bd_pins iodelay_if_0/iodly_17__tap_load] [get_bd_pins v2nfc_2/iDQ1IDelayTapLoad]
connect_bd_net [get_bd_pins iodelay_if_0/iodly_18__tap] [get_bd_pins v2nfc_2/iDQ2IDelayTap]
connect_bd_net [get_bd_pins iodelay_if_0/iodly_18__tap_load] [get_bd_pins v2nfc_2/iDQ2IDelayTapLoad]
connect_bd_net [get_bd_pins iodelay_if_0/iodly_19__tap] [get_bd_pins v2nfc_2/iDQ3IDelayTap]
connect_bd_net [get_bd_pins iodelay_if_0/iodly_19__tap_load] [get_bd_pins v2nfc_2/iDQ3IDelayTapLoad]
connect_bd_net [get_bd_pins iodelay_if_0/iodly_20__tap] [get_bd_pins v2nfc_2/iDQ4IDelayTap]
connect_bd_net [get_bd_pins iodelay_if_0/iodly_20__tap_load] [get_bd_pins v2nfc_2/iDQ4IDelayTapLoad]
connect_bd_net [get_bd_pins iodelay_if_0/iodly_21__tap] [get_bd_pins v2nfc_2/iDQ5IDelayTap]
connect_bd_net [get_bd_pins iodelay_if_0/iodly_21__tap_load] [get_bd_pins v2nfc_2/iDQ5IDelayTapLoad]
connect_bd_net [get_bd_pins iodelay_if_0/iodly_22__tap] [get_bd_pins v2nfc_2/iDQ6IDelayTap]
connect_bd_net [get_bd_pins iodelay_if_0/iodly_22__tap_load] [get_bd_pins v2nfc_2/iDQ6IDelayTapLoad]
connect_bd_net [get_bd_pins iodelay_if_0/iodly_23__tap] [get_bd_pins v2nfc_2/iDQ7IDelayTap]
connect_bd_net [get_bd_pins iodelay_if_0/iodly_23__tap_load] [get_bd_pins v2nfc_2/iDQ7IDelayTapLoad]
connect_bd_net [get_bd_pins iodelay_if_0/iodly_24__tap] [get_bd_pins v2nfc_3/iDQ0IDelayTap]
connect_bd_net [get_bd_pins iodelay_if_0/iodly_24__tap_load] [get_bd_pins v2nfc_3/iDQ0IDelayTapLoad]
connect_bd_net [get_bd_pins iodelay_if_0/iodly_25__tap] [get_bd_pins v2nfc_3/iDQ1IDelayTap]
connect_bd_net [get_bd_pins iodelay_if_0/iodly_25__tap_load] [get_bd_pins v2nfc_3/iDQ1IDelayTapLoad]
connect_bd_net [get_bd_pins iodelay_if_0/iodly_26__tap] [get_bd_pins v2nfc_3/iDQ2IDelayTap]
connect_bd_net [get_bd_pins iodelay_if_0/iodly_26__tap_load] [get_bd_pins v2nfc_3/iDQ2IDelayTapLoad]
connect_bd_net [get_bd_pins iodelay_if_0/iodly_27__tap] [get_bd_pins v2nfc_3/iDQ3IDelayTap]
connect_bd_net [get_bd_pins iodelay_if_0/iodly_27__tap_load] [get_bd_pins v2nfc_3/iDQ3IDelayTapLoad]
connect_bd_net [get_bd_pins iodelay_if_0/iodly_28__tap] [get_bd_pins v2nfc_3/iDQ4IDelayTap]
connect_bd_net [get_bd_pins iodelay_if_0/iodly_28__tap_load] [get_bd_pins v2nfc_3/iDQ4IDelayTapLoad]
connect_bd_net [get_bd_pins iodelay_if_0/iodly_29__tap] [get_bd_pins v2nfc_3/iDQ5IDelayTap]
connect_bd_net [get_bd_pins iodelay_if_0/iodly_29__tap_load] [get_bd_pins v2nfc_3/iDQ5IDelayTapLoad]
connect_bd_net [get_bd_pins iodelay_if_0/iodly_30__tap] [get_bd_pins v2nfc_3/iDQ6IDelayTap]
connect_bd_net [get_bd_pins iodelay_if_0/iodly_30__tap_load] [get_bd_pins v2nfc_3/iDQ6IDelayTapLoad]
connect_bd_net [get_bd_pins iodelay_if_0/iodly_31__tap] [get_bd_pins v2nfc_3/iDQ7IDelayTap]
connect_bd_net [get_bd_pins iodelay_if_0/iodly_31__tap_load] [get_bd_pins v2nfc_3/iDQ7IDelayTapLoad]
connect_bd_net [get_bd_pins iodelay_if_0_dqs/iodly_00__tap] [get_bd_pins v2nfc_0/iDQSIDelayTap]
connect_bd_net [get_bd_pins iodelay_if_0_dqs/iodly_00__tap_load] [get_bd_pins v2nfc_0/iDQSIDelayTapLoad]
connect_bd_net [get_bd_pins iodelay_if_0_dqs/iodly_01__tap] [get_bd_pins v2nfc_1/iDQSIDelayTap]
connect_bd_net [get_bd_pins iodelay_if_0_dqs/iodly_01__tap_load] [get_bd_pins v2nfc_1/iDQSIDelayTapLoad]
connect_bd_net [get_bd_pins iodelay_if_0_dqs/iodly_02__tap] [get_bd_pins v2nfc_2/iDQSIDelayTap]
connect_bd_net [get_bd_pins iodelay_if_0_dqs/iodly_02__tap_load] [get_bd_pins v2nfc_2/iDQSIDelayTapLoad]
connect_bd_net [get_bd_pins iodelay_if_0_dqs/iodly_03__tap] [get_bd_pins v2nfc_3/iDQSIDelayTap]
connect_bd_net [get_bd_pins iodelay_if_0_dqs/iodly_03__tap_load] [get_bd_pins v2nfc_3/iDQSIDelayTapLoad]
connect_bd_net [get_bd_pins zynq_ultra_ps_e_0/pl_resetn0] \
  [get_bd_pins proc_sys_reset_0/ext_reset_in] [get_bd_pins pll_bank13_psr/ext_reset_in] \
  [get_bd_pins pll_bank11_psr/ext_reset_in] [get_bd_pins pll_bank12_psr/ext_reset_in] \
  [get_bd_pins pll_bank10_psr/ext_reset_in]
connect_bd_net [get_bd_pins zynq_ultra_ps_e_0/pl_resetn1] [get_bd_pins proc_sys_reset_2/ext_reset_in]
connect_bd_net [get_bd_pins pll_bank11/clk_out2] \
  [get_bd_pins pll_bank11_psr/slowest_sync_clk] [get_bd_pins axi_bram_ctrl_1/s_axi_aclk] [get_bd_pins t4nfc_hlper_1/iClock] \
  [get_bd_pins bch_sccs_256B_21B_13b_1/iClock] [get_bd_pins gpic_0_sub_0/M02_ACLK] [get_bd_pins gpic_0_sub_0/M03_ACLK] \
  [get_bd_pins hpic_0/S01_ACLK] [get_bd_pins v2nfc_1/iSystemClock]
connect_bd_net [get_bd_pins pll_bank12/clk_out2] \
  [get_bd_pins pll_bank12_psr/slowest_sync_clk] [get_bd_pins axi_bram_ctrl_2/s_axi_aclk] \
  [get_bd_pins bch_sccs_256B_21B_13b_2/iClock] [get_bd_pins t4nfc_hlper_2/iClock] [get_bd_pins gpic_0_sub_0/M04_ACLK] \
  [get_bd_pins gpic_0_sub_0/M05_ACLK] [get_bd_pins hpic_0/S02_ACLK] [get_bd_pins v2nfc_2/iSystemClock]
connect_bd_net [get_bd_pins pll_bank13/clk_out2] \
  [get_bd_pins pll_bank13_psr/slowest_sync_clk] [get_bd_pins axi_bram_ctrl_3/s_axi_aclk] [get_bd_pins t4nfc_hlper_3/iClock] \
  [get_bd_pins bch_sccs_256B_21B_13b_3/iClock] [get_bd_pins gpic_0_sub_0/M06_ACLK] [get_bd_pins gpic_0_sub_0/M07_ACLK] \
  [get_bd_pins hpic_0/S03_ACLK] [get_bd_pins v2nfc_3/iSystemClock]
connect_bd_net -net proc_sys_reset_1_peripheral_reset [get_bd_pins pll_bank13_psr/peripheral_reset] \
  [get_bd_pins t4nfc_hlper_3/iReset] [get_bd_pins bch_sccs_256B_21B_13b_3/iReset] [get_bd_pins v2nfc_3/iReset]
connect_bd_net -net proc_sys_reset_3_peripheral_reset [get_bd_pins pll_bank11_psr/peripheral_reset] \
  [get_bd_pins t4nfc_hlper_1/iReset] [get_bd_pins bch_sccs_256B_21B_13b_1/iReset] [get_bd_pins v2nfc_1/iReset]
connect_bd_net -net proc_sys_reset_4_peripheral_reset [get_bd_pins pll_bank12_psr/peripheral_reset] \
  [get_bd_pins bch_sccs_256B_21B_13b_2/iReset] [get_bd_pins t4nfc_hlper_2/iReset] [get_bd_pins v2nfc_2/iReset]
connect_bd_net [get_bd_pins pll_bank10/clk_out2] \
  [get_bd_pins pll_bank10_psr/slowest_sync_clk] [get_bd_pins axi_bram_ctrl_0/s_axi_aclk] [get_bd_pins t4nfc_hlper_0/iClock] \
  [get_bd_pins gpic_0_sub_0/M00_ACLK] [get_bd_pins gpic_0_sub_0/M01_ACLK] [get_bd_pins bch_sccs_256B_21B_13b_0/iClock] \
  [get_bd_pins hpic_0/S00_ACLK] [get_bd_pins v2nfc_0/iSystemClock]
connect_bd_net -net proc_sys_reset_5_peripheral_reset [get_bd_pins pll_bank10_psr/peripheral_reset] \
  [get_bd_pins t4nfc_hlper_0/iReset] [get_bd_pins bch_sccs_256B_21B_13b_0/iReset] [get_bd_pins v2nfc_0/iReset]
connect_bd_net -net proc_sys_reset_5_peripheral_aresetn [get_bd_pins pll_bank10_psr/peripheral_aresetn] [get_bd_pins axi_bram_ctrl_0/s_axi_aresetn]
connect_bd_net -net M00_ARESETN_2 [get_bd_pins pll_bank10_psr/interconnect_aresetn] \
  [get_bd_pins gpic_0_sub_0/M00_ARESETN] [get_bd_pins gpic_0_sub_0/M01_ARESETN] [get_bd_pins hpic_0/S00_ARESETN]
connect_bd_net -net proc_sys_reset_3_peripheral_aresetn [get_bd_pins pll_bank11_psr/peripheral_aresetn] [get_bd_pins axi_bram_ctrl_1/s_axi_aresetn]
connect_bd_net -net M02_ARESETN_1 [get_bd_pins pll_bank11_psr/interconnect_aresetn] \
  [get_bd_pins gpic_0_sub_0/M02_ARESETN] [get_bd_pins gpic_0_sub_0/M03_ARESETN] [get_bd_pins hpic_0/S01_ARESETN]
connect_bd_net -net proc_sys_reset_4_peripheral_aresetn [get_bd_pins pll_bank12_psr/peripheral_aresetn] [get_bd_pins axi_bram_ctrl_2/s_axi_aresetn]
connect_bd_net -net M04_ARESETN_1 [get_bd_pins pll_bank12_psr/interconnect_aresetn] \
  [get_bd_pins gpic_0_sub_0/M04_ARESETN] [get_bd_pins gpic_0_sub_0/M05_ARESETN] [get_bd_pins hpic_0/S02_ARESETN]
connect_bd_net -net proc_sys_reset_1_peripheral_aresetn [get_bd_pins pll_bank13_psr/peripheral_aresetn] [get_bd_pins axi_bram_ctrl_3/s_axi_aresetn]
connect_bd_net -net M06_ARESETN_1 [get_bd_pins pll_bank13_psr/interconnect_aresetn] \
  [get_bd_pins gpic_0_sub_0/M06_ARESETN] [get_bd_pins gpic_0_sub_0/M07_ARESETN] [get_bd_pins hpic_0/S03_ARESETN]
connect_bd_net [get_bd_pins pll_bank10/locked] [get_bd_pins pll_bank10_psr/dcm_locked]
connect_bd_net -net CH0C133BUF_BUFGCE_O [get_bd_pins pll_bank10/clk_out1] \
  [get_bd_pins v2nfc_0/iOutputDrivingClock] [get_bd_pins v2nfc_0/iOutputStrobeClock]
connect_bd_net [get_bd_pins pll_bank11/locked] [get_bd_pins pll_bank11_psr/dcm_locked]
connect_bd_net -net CH1C133BUF_BUFGCE_O [get_bd_pins pll_bank11/clk_out1] \
  [get_bd_pins v2nfc_1/iOutputDrivingClock] [get_bd_pins v2nfc_1/iOutputStrobeClock]
connect_bd_net [get_bd_pins pll_bank12/locked] [get_bd_pins pll_bank12_psr/dcm_locked]
connect_bd_net -net CH2C133BUF_BUFGCE_O [get_bd_pins pll_bank12/clk_out1] \
  [get_bd_pins v2nfc_2/iOutputDrivingClock] [get_bd_pins v2nfc_2/iOutputStrobeClock]
connect_bd_net [get_bd_pins pll_bank13/locked] [get_bd_pins pll_bank13_psr/dcm_locked]
connect_bd_net -net CH3C133BUF_BUFGCE_O [get_bd_pins pll_bank13/clk_out1] \
  [get_bd_pins v2nfc_3/iOutputDrivingClock] [get_bd_pins v2nfc_3/iOutputStrobeClock]
connect_bd_net [get_bd_pins pll_bank10/clk_out3] [get_bd_pins v2nfc_0/iDelayRefClock]
connect_bd_net [get_bd_pins pll_bank11/clk_out3] [get_bd_pins v2nfc_1/iDelayRefClock]
connect_bd_net [get_bd_pins pll_bank12/clk_out3] [get_bd_pins v2nfc_2/iDelayRefClock]
connect_bd_net [get_bd_pins pll_bank13/clk_out3] [get_bd_pins v2nfc_3/iDelayRefClock]
connect_bd_net [get_bd_pins nvme_ctrl_0/user_lnk_up] [get_bd_ports user_lnk_up_0]
connect_bd_net [get_bd_pins xlconcat_0/dout] [get_bd_pins zynq_ultra_ps_e_0/pl_ps_irq0]
connect_bd_net [get_bd_pins nvme_ctrl_0/dev_irq_assert] [get_bd_pins xlconcat_0/In0]
connect_bd_net -net pcie_perst_n_0_1 [get_bd_ports pcie_perst_n] [get_bd_pins nvme_ctrl_0/pcie_perst_n]
connect_bd_net [get_bd_pins zynq_ultra_ps_e_0/pl_clk3] \
  [get_bd_pins zynq_ultra_ps_e_0/saxihp1_fpd_aclk] [get_bd_pins smartconnect_0/aclk] \
  [get_bd_pins proc_sys_reset_6/slowest_sync_clk] [get_bd_pins nvme_ctrl_0/m0_axi_aclk]
connect_bd_net [get_bd_pins zynq_ultra_ps_e_0/pl_resetn3] [get_bd_pins proc_sys_reset_6/ext_reset_in]
connect_bd_net [get_bd_pins proc_sys_reset_6/peripheral_aresetn] [get_bd_pins smartconnect_0/aresetn] [get_bd_pins nvme_ctrl_0/m0_axi_aresetn]
connect_bd_net [get_bd_pins zynq_ultra_ps_e_0/pl_clk2] \
  [get_bd_pins proc_sys_reset_7/slowest_sync_clk] [get_bd_pins gpic_1/M01_ACLK] [get_bd_pins nvme_ctrl_0/s0_axi_aclk]
connect_bd_net [get_bd_pins zynq_ultra_ps_e_0/pl_resetn2] [get_bd_pins proc_sys_reset_7/ext_reset_in]
connect_bd_net [get_bd_pins proc_sys_reset_7/peripheral_aresetn] [get_bd_pins gpic_1/M01_ARESETN] [get_bd_pins nvme_ctrl_0/s0_axi_aresetn]
set_property HDL_ATTRIBUTE.BMM_INFO_ADDRESS_SPACE {byte  0x45000000 32 > sys_top blk_mem_gen_0} [get_bd_cells axi_bram_ctrl_0]
set_property HDL_ATTRIBUTE.KEEP_HIERARCHY yes [get_bd_cells axi_bram_ctrl_0]
set_property HDL_ATTRIBUTE.BMM_INFO_ADDRESS_SPACE {byte  0x45100000 32 > sys_top blk_mem_gen_1} [get_bd_cells axi_bram_ctrl_1]
set_property HDL_ATTRIBUTE.KEEP_HIERARCHY yes [get_bd_cells axi_bram_ctrl_1]
set_property HDL_ATTRIBUTE.BMM_INFO_ADDRESS_SPACE {byte  0x45200000 32 > sys_top blk_mem_gen_2} [get_bd_cells axi_bram_ctrl_2]
set_property HDL_ATTRIBUTE.KEEP_HIERARCHY yes [get_bd_cells axi_bram_ctrl_2]
set_property HDL_ATTRIBUTE.BMM_INFO_ADDRESS_SPACE {byte  0x45300000 32 > sys_top blk_mem_gen_3} [get_bd_cells axi_bram_ctrl_3]
set_property HDL_ATTRIBUTE.KEEP_HIERARCHY yes [get_bd_cells axi_bram_ctrl_3]

# ---- address map ----
assign_bd_address -offset 0x00000000 -range 2G -target_address_space [get_bd_addr_spaces nvme_ctrl_0/m0_axi] [get_bd_addr_segs zynq_ultra_ps_e_0/SAXIGP3/HP1_DDR_LOW]
exclude_bd_addr_seg -offset 0xC0000000 -range 512M -target_address_space [get_bd_addr_spaces nvme_ctrl_0/m0_axi] [get_bd_addr_segs zynq_ultra_ps_e_0/SAXIGP3/HP1_QSPI]
exclude_bd_addr_seg -offset 0xFF000000 -range 16M -target_address_space [get_bd_addr_spaces nvme_ctrl_0/m0_axi] [get_bd_addr_segs zynq_ultra_ps_e_0/SAXIGP3/HP1_LPS_OCM]
assign_bd_address -offset 0x00000000 -range 2G -target_address_space [get_bd_addr_spaces t4nfc_hlper_0/D] [get_bd_addr_segs zynq_ultra_ps_e_0/SAXIGP2/HP0_DDR_LOW]
exclude_bd_addr_seg -offset 0xC0000000 -range 512M -target_address_space [get_bd_addr_spaces t4nfc_hlper_0/D] [get_bd_addr_segs zynq_ultra_ps_e_0/SAXIGP2/HP0_QSPI]
exclude_bd_addr_seg -offset 0xFF000000 -range 16M -target_address_space [get_bd_addr_spaces t4nfc_hlper_0/D] [get_bd_addr_segs zynq_ultra_ps_e_0/SAXIGP2/HP0_LPS_OCM]
assign_bd_address -offset 0x00000000 -range 2G -target_address_space [get_bd_addr_spaces t4nfc_hlper_1/D] [get_bd_addr_segs zynq_ultra_ps_e_0/SAXIGP2/HP0_DDR_LOW]
exclude_bd_addr_seg -offset 0xC0000000 -range 512M -target_address_space [get_bd_addr_spaces t4nfc_hlper_1/D] [get_bd_addr_segs zynq_ultra_ps_e_0/SAXIGP2/HP0_QSPI]
exclude_bd_addr_seg -offset 0xFF000000 -range 16M -target_address_space [get_bd_addr_spaces t4nfc_hlper_1/D] [get_bd_addr_segs zynq_ultra_ps_e_0/SAXIGP2/HP0_LPS_OCM]
assign_bd_address -offset 0x00000000 -range 2G -target_address_space [get_bd_addr_spaces t4nfc_hlper_2/D] [get_bd_addr_segs zynq_ultra_ps_e_0/SAXIGP2/HP0_DDR_LOW]
exclude_bd_addr_seg -offset 0xC0000000 -range 512M -target_address_space [get_bd_addr_spaces t4nfc_hlper_2/D] [get_bd_addr_segs zynq_ultra_ps_e_0/SAXIGP2/HP0_QSPI]
exclude_bd_addr_seg -offset 0xFF000000 -range 16M -target_address_space [get_bd_addr_spaces t4nfc_hlper_2/D] [get_bd_addr_segs zynq_ultra_ps_e_0/SAXIGP2/HP0_LPS_OCM]
assign_bd_address -offset 0x00000000 -range 2G -target_address_space [get_bd_addr_spaces t4nfc_hlper_3/D] [get_bd_addr_segs zynq_ultra_ps_e_0/SAXIGP2/HP0_DDR_LOW]
exclude_bd_addr_seg -offset 0xC0000000 -range 512M -target_address_space [get_bd_addr_spaces t4nfc_hlper_3/D] [get_bd_addr_segs zynq_ultra_ps_e_0/SAXIGP2/HP0_QSPI]
exclude_bd_addr_seg -offset 0xFF000000 -range 16M -target_address_space [get_bd_addr_spaces t4nfc_hlper_3/D] [get_bd_addr_segs zynq_ultra_ps_e_0/SAXIGP2/HP0_LPS_OCM]
assign_bd_address -offset 0x00A0000000 -range 4K -target_address_space [get_bd_addr_spaces zynq_ultra_ps_e_0/Data] [get_bd_addr_segs axi_bram_ctrl_0/S_AXI/Mem0]
assign_bd_address -offset 0x00A0001000 -range 4K -target_address_space [get_bd_addr_spaces zynq_ultra_ps_e_0/Data] [get_bd_addr_segs axi_bram_ctrl_1/S_AXI/Mem0]
assign_bd_address -offset 0x00A0002000 -range 4K -target_address_space [get_bd_addr_spaces zynq_ultra_ps_e_0/Data] [get_bd_addr_segs axi_bram_ctrl_2/S_AXI/Mem0]
assign_bd_address -offset 0x00A0003000 -range 4K -target_address_space [get_bd_addr_spaces zynq_ultra_ps_e_0/Data] [get_bd_addr_segs axi_bram_ctrl_3/S_AXI/Mem0]
assign_bd_address -offset 0x00A0010000 -range 64K -target_address_space [get_bd_addr_spaces zynq_ultra_ps_e_0/Data] [get_bd_addr_segs t4nfc_hlper_0/C/reg0]
assign_bd_address -offset 0x00A0020000 -range 64K -target_address_space [get_bd_addr_spaces zynq_ultra_ps_e_0/Data] [get_bd_addr_segs t4nfc_hlper_1/C/reg0]
assign_bd_address -offset 0x00A0030000 -range 64K -target_address_space [get_bd_addr_spaces zynq_ultra_ps_e_0/Data] [get_bd_addr_segs t4nfc_hlper_2/C/reg0]
assign_bd_address -offset 0x00A0040000 -range 64K -target_address_space [get_bd_addr_spaces zynq_ultra_ps_e_0/Data] [get_bd_addr_segs t4nfc_hlper_3/C/reg0]
assign_bd_address -offset 0x00B0000000 -range 64K -target_address_space [get_bd_addr_spaces zynq_ultra_ps_e_0/Data] [get_bd_addr_segs iodelay_if_0/ctrl__s/reg0]
assign_bd_address -offset 0x00B0010000 -range 64K -target_address_space [get_bd_addr_spaces zynq_ultra_ps_e_0/Data] [get_bd_addr_segs iodelay_if_0_dqs/ctrl__s/reg0]
assign_bd_address -offset 0x00B0020000 -range 128K -target_address_space [get_bd_addr_spaces zynq_ultra_ps_e_0/Data] [get_bd_addr_segs nvme_ctrl_0/s0_axi/reg0]

validate_bd_design
save_bd_design
